# Altium schematic sheet ife18_TS_BMS_Master_v1.SchDoc
size A
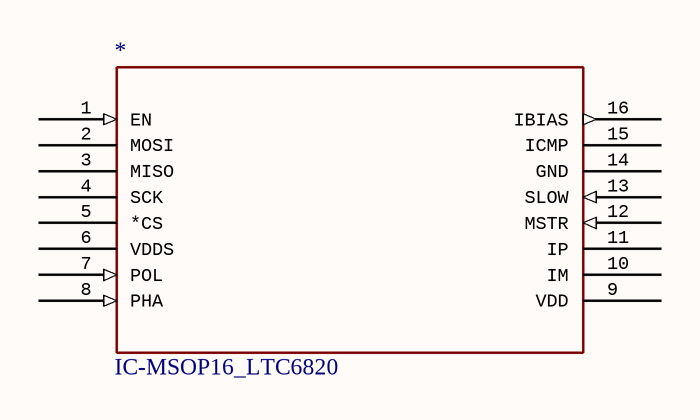
[diagram p0: ife18_TS_BMS_Master_v1.SchDoc]

## Parts
*  IC-MSOP16_LTC6820  [MSOP16]

## Nets

Not connected (* = marked no-connect by the designer): * 1(EN) 2(MOSI) 3(MISO) 4(SCK) 5(*CS) 6(VDDS) 7(POL) 8(PHA) 9(VDD) 10(IM) 11(IP) 12(MSTR) 13(SLOW) 14(GND) 15(ICMP) 16(IBIAS)